# Altium schematic sheet Schematic.SchDoc
size A4
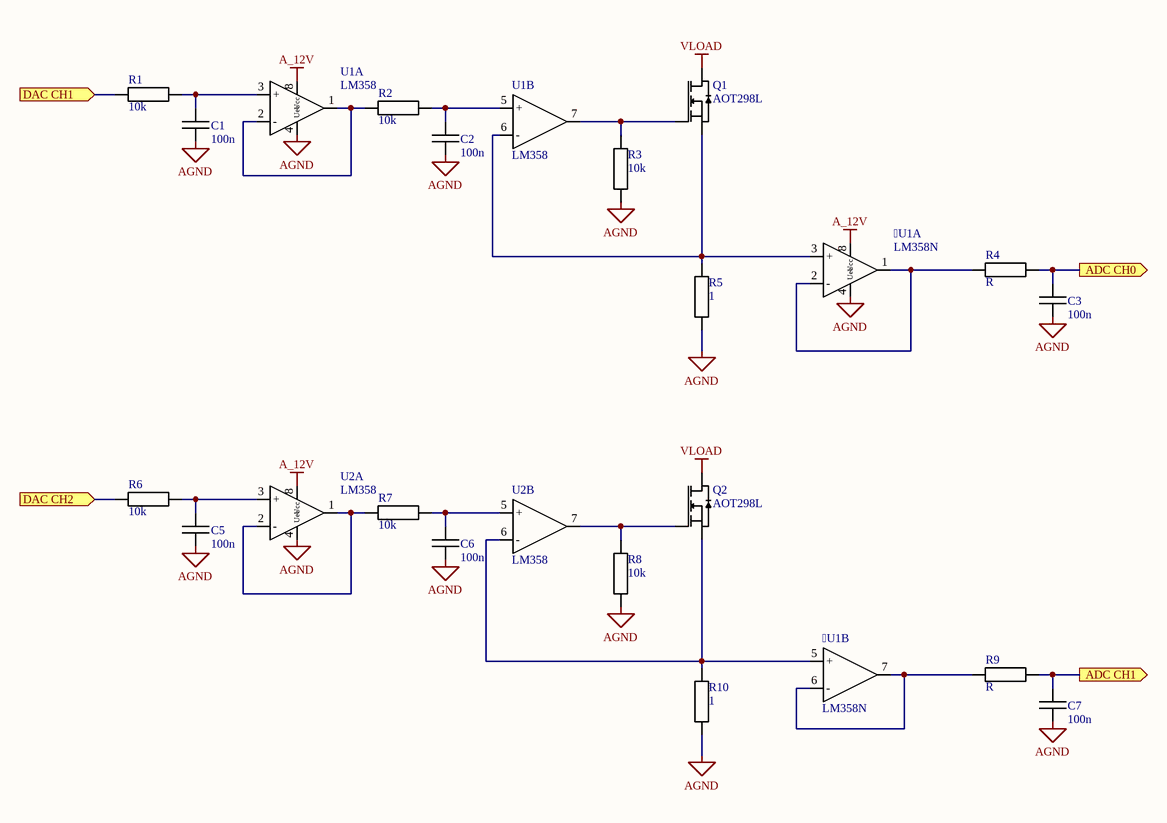
[diagram p0: Schematic.SchDoc]

## Parts
U1  LM358N  [SO 08]  (parts A,B of 2)
C1  Capacitance: 100n  [1206 package]  (hidden comment: Ceramic Capacitor)
C2  Capacitance: 100n  [1206 package]  (hidden comment: Ceramic Capacitor)
C3  Capacitance: 100n  [1206 package]  (hidden comment: Ceramic Capacitor)
C5  Capacitance: 100n  [1206 package]  (hidden comment: Ceramic Capacitor)
C6  Capacitance: 100n  [1206 package]  (hidden comment: Ceramic Capacitor)
C7  Capacitance: 100n  [1206 package]  (hidden comment: Ceramic Capacitor)
Q1  AOT298L
Q2  AOT298L
R1  Resistance: 10k  [1206 package]  (hidden comment: SMD Resistor)
R2  Resistance: 10k  [1206 package]  (hidden comment: SMD Resistor)
R3  Resistance: 10k  [1206 package]  (hidden comment: SMD Resistor)
R4  Resistance: R  [1206 package]  (hidden comment: SMD Resistor)
R5  Resistance: 1  [1206 package]  (hidden comment: SMD Resistor)
R6  Resistance: 10k  [1206 package]  (hidden comment: SMD Resistor)
R7  Resistance: 10k  [1206 package]  (hidden comment: SMD Resistor)
R8  Resistance: 10k  [1206 package]  (hidden comment: SMD Resistor)
R9  Resistance: R  [1206 package]  (hidden comment: SMD Resistor)
R10  Resistance: 1  [1206 package]  (hidden comment: SMD Resistor)
U1  LM358  (parts A,B of 2)
U2  LM358  (parts A,B of 2)

## Ports
ADC CH0 (out), ADC CH1 (out), DAC CH1 (in), DAC CH2 (in)

## Nets
A_12V: U1.8(Ucc) U1.8(Ucc) U2.8(Ucc)
AGND: U1.4(Uee) C1.1 C2.1 C3.1 C5.1 C6.1 C7.1 R3.1 R5.1 R8.1 R10.1 U1.4(Uee) U2.4(Uee)
VLOAD: Q1.2(D) Q2.2(D)
ADC CH0: C3.2 R4.2 ; port ADC CH0
ADC CH1: C7.2 R9.2 ; port ADC CH1
DAC CH1: R1.1 ; port DAC CH1
DAC CH2: R6.1 ; port DAC CH2
NetU1_1: U1.1 U1.2(-) R4.1
NetU1_3: U1.3(+) Q1.3(S) R5.2 U1.6(-)
NetU1_5: U1.5(+) Q2.3(S) R10.2 U2.6(-)
NetU1_6: U1.6(-) U1.7 R9.1
NetC1_2: C1.2 R1.2 U1.3(+)
NetC2_2: C2.2 R2.2 U1.5(+)
NetC5_2: C5.2 R6.2 U2.3(+)
NetC6_2: C6.2 R7.2 U2.5(+)
NetQ1_1: Q1.1(G) R3.2 U1.7
NetQ2_1: Q2.1(G) R8.2 U2.7
NetR2_1: R2.1 U1.1 U1.2(-)
NetR7_1: R7.1 U2.1 U2.2(-)

## Library data of the parts
U1 = LM358N: TL072CD-T Dual OPAMP
Q1 Q2 = AOT298L: NMOS / VGS = 100V / IDmax = 41A / Rdson = 14.5mOhm
R1-R10 = Resistor